# Altium schematic sheet WiFi_TF_EMMC.SchDoc
size A3; SheetNumber: 6; SheetTotal: 6
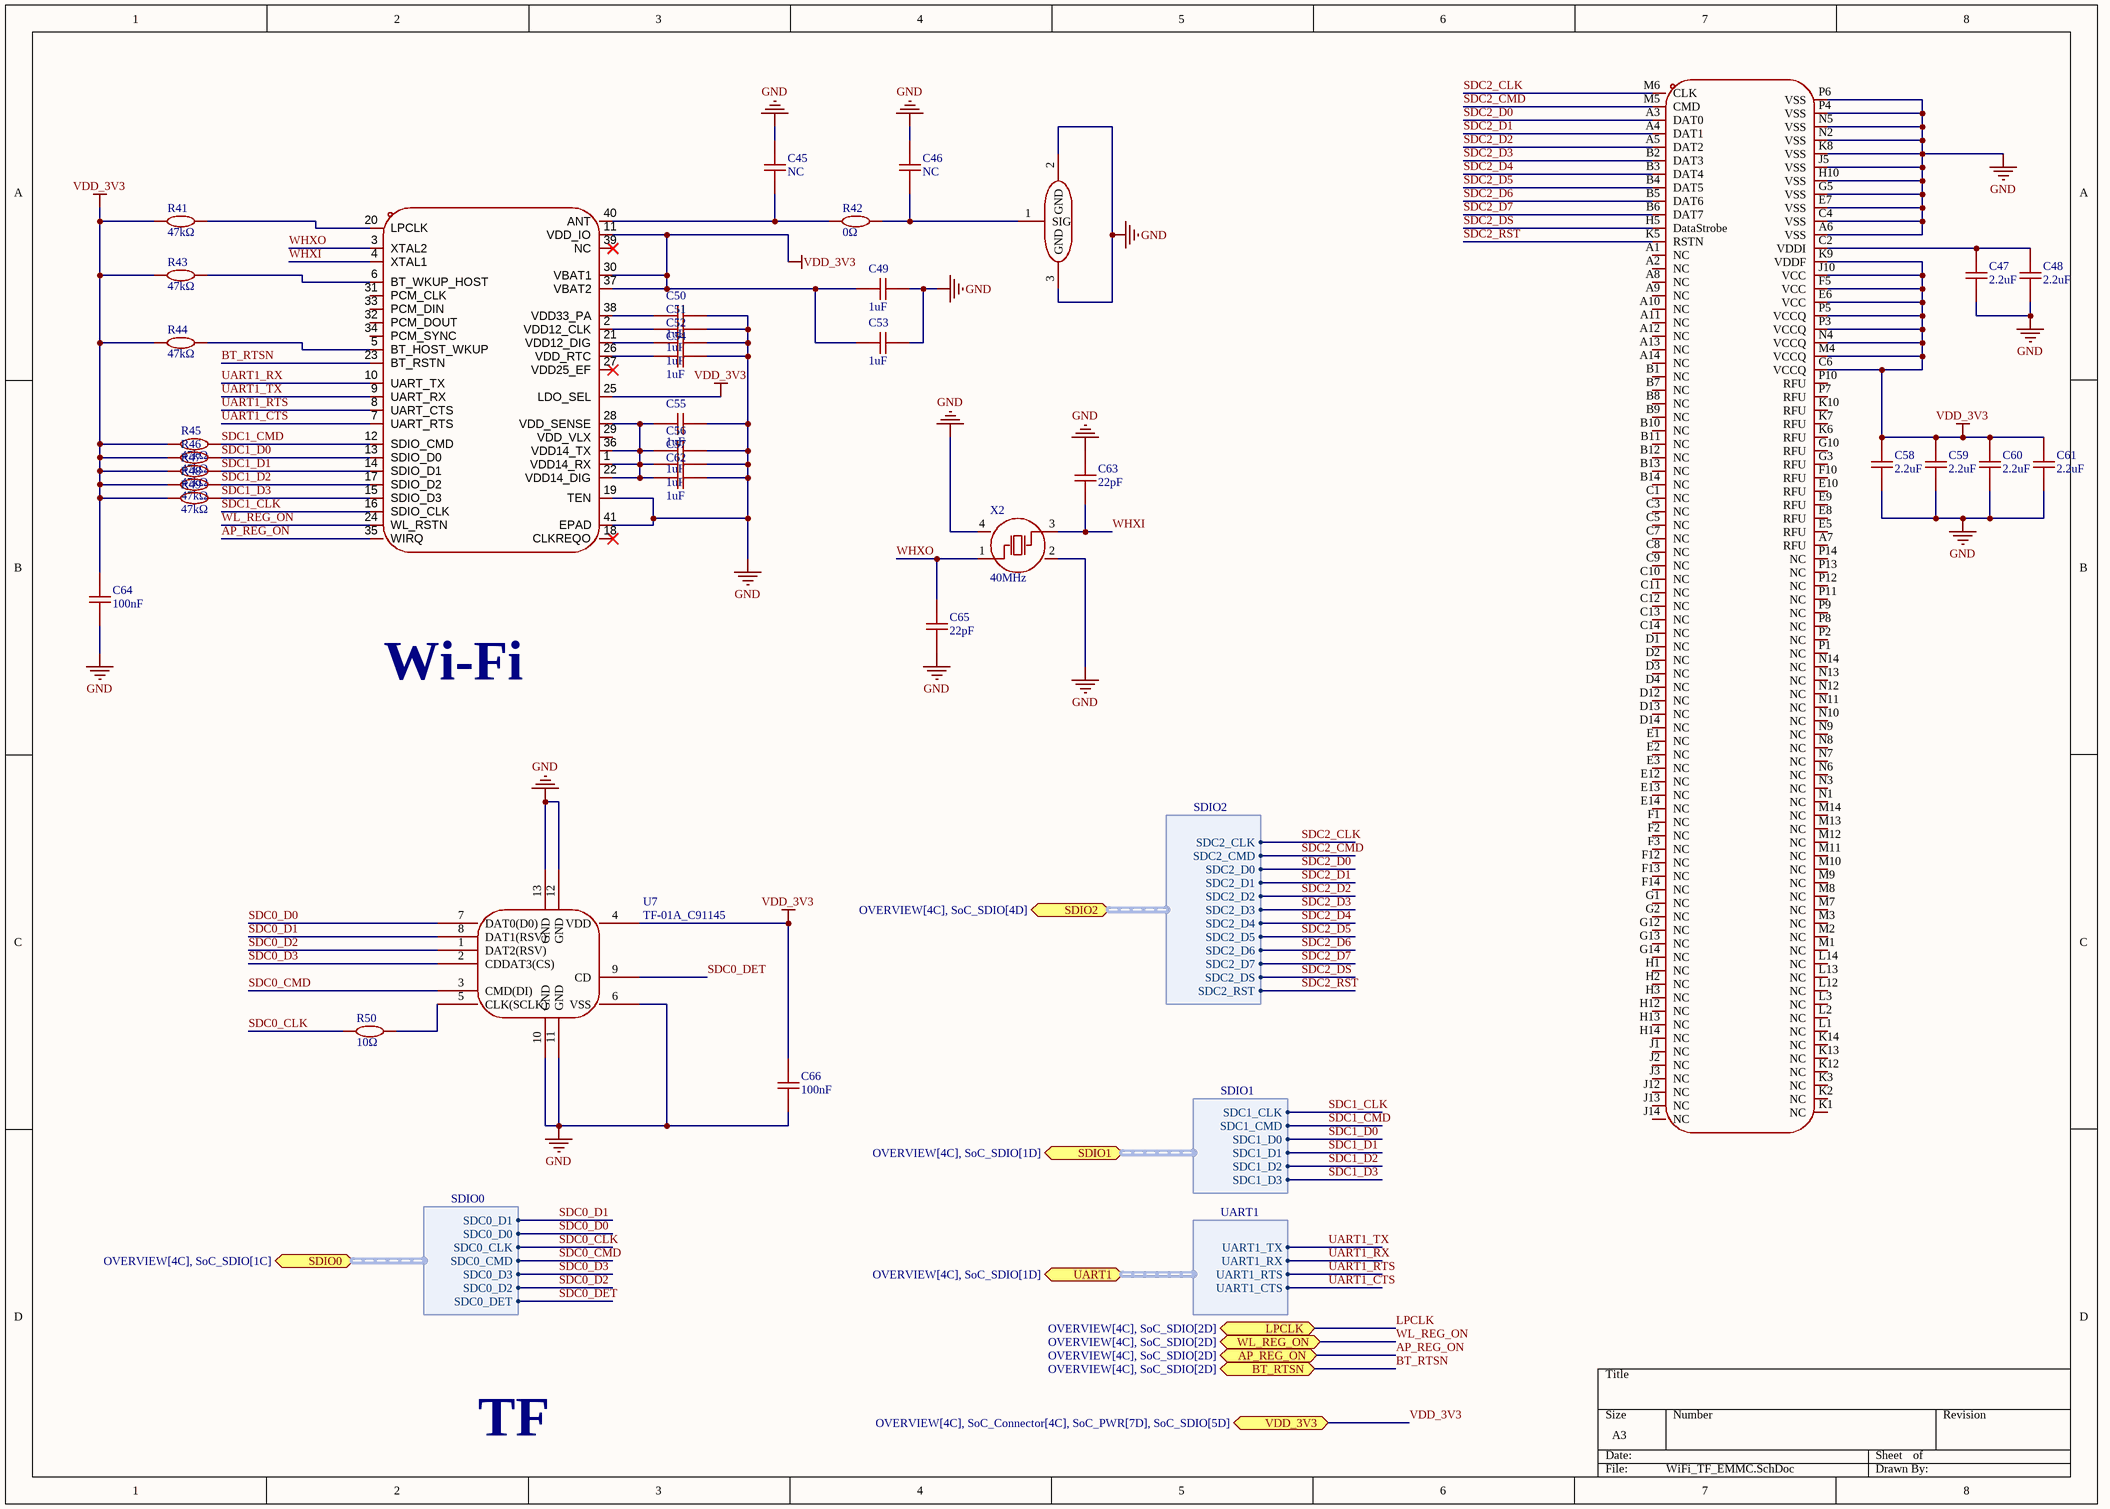
[diagram p0: WiFi_TF_EMMC.SchDoc]

## Parts
C45  NC  [C0402]
C46  NC  [C0402]
C47  2.2uF  [C0402]
C48  2.2uF  [C0402]
C49  1uF  [C0402]
C50  1uF  [C0402]
C51  1uF  [C0402]
C52  1uF  [C0402]
C53  1uF  [C0402]
C54  1uF  [C0402]
C55  1uF  [C0402]
C56  1uF  [C0402]
C57  1uF  [C0402]
C58  2.2uF  [C0402]
C59  2.2uF  [C0402]
C60  2.2uF  [C0402]
C61  2.2uF  [C0402]
C62  1uF  [C0402]
C63  22pF  [C0402]
C64  100nF  [C0402]
C65  22pF  [C0402]
C66  100nF  [C0402]
JP1  6GHz  [RF-SMD_FRF05002-JSS103M]  (value not drawn)
R41  47kΩ  [R0402]
R42  0Ω  [R0402]
R43  47kΩ  [R0402]
R44  47kΩ  [R0402]
R45  47kΩ  [R0402]
R46  47kΩ  [R0402]
R47  47kΩ  [R0402]
R48  47kΩ  [R0402]
R49  47kΩ  [R0402]
R50  10Ω  [R0402]
U6  XR829  [QFN-40_L5.0-W5.0-P0.40-BL-EP3.4]  (value not drawn)
U7  TF-01A_C91145  [TF-SMD_TF-01A]
U8  KLM8G1GETF-B041  [FBGA-153_L13.0-W11.5-P0.50_KLMAG1JETD-B041]  (value not drawn)
X2  40MHz  [OSC-SMD_4P-L3.2-W2.5-BL_SIT8008BI]

## Ports
AP_REG_ON (bidir, see OVERVIEW[4C], SoC_SDIO[2D]), BT_RTSN (bidir, see OVERVIEW[4C], SoC_SDIO[2D]), LPCLK (bidir, see OVERVIEW[4C], SoC_SDIO[2D]), SDIO0 (bidir, harness SDIO0, see OVERVIEW[4C], SoC_SDIO[1C]), SDIO1 (bidir, harness SDIO1, see OVERVIEW[4C], SoC_SDIO[1D]), SDIO2 (bidir, harness SDIO2, see OVERVIEW[4C], SoC_SDIO[4D]), UART1 (bidir, harness UART1, see OVERVIEW[4C], SoC_SDIO[1D]), VDD_3V3 (bidir, see OVERVIEW[4C], SoC_Connector[4C], SoC_PWR[7D], SoC_SDIO[5D]), WL_REG_ON (bidir, see OVERVIEW[4C], SoC_SDIO[2D])

## Harnesses
SDIO1: SDC1_D0, SDC1_D1, SDC1_CMD, SDC1_D2, SDC1_D3, SDC1_CLK
UART1: UART1_RX, UART1_RTS, UART1_TX, UART1_CTS
SDIO0: SDC0_CLK, SDC0_CMD, SDC0_D0, SDC0_D3, SDC0_D2, SDC0_D1, SDC0_DET
SDIO2: SDC2_D2, SDC2_D3, SDC2_D1, SDC2_D4, SDC2_D5, SDC2_D0, SDC2_CMD, SDC2_CLK, SDC2_D6, SDC2_D7, SDC2_DS, SDC2_RST

## Nets
GND: C45.2 C46.2 C47.1 C48.1 C49.1 C50.1 C51.1 C52.1 C53.1 C54.1 C55.1 C56.1 C57.1 C58.1 C59.1 C60.1 C61.1 C62.1 C63.2 C64.1 C65.1 C66.1 JP1.2(GND) JP1.3(GND) U6.19(TEN) U6.41(EPAD) U7.6(VSS) U7.10(GND) U7.11(GND) U7.12(GND) U7.13(GND) U8.A6(VSS) U8.C4(VSS) U8.E7(VSS) U8.G5(VSS) U8.H10(VSS) U8.J5(VSS) U8.K8(VSS) U8.N2(VSS) U8.N5(VSS) U8.P4(VSS) U8.P6(VSS) X2.2(GND) X2.4(GND)
VDD_3V3: C49.2 C53.2 C58.2 C59.2 C60.2 C61.2 C64.2 C66.2 R41.1 R43.1 R44.1 R45.1 R46.1 R47.1 R48.1 R49.1 U6.11(VDD_IO) U6.25(LDO_SEL) U6.30(VBAT1) U6.37(VBAT2) U7.4(VDD) U8.C6(VCCQ) U8.E6(VCC) U8.F5(VCC) U8.J10(VCC) U8.K9(VDDF) U8.M4(VCCQ) U8.N4(VCCQ) U8.P3(VCCQ) U8.P5(VCCQ) ; port VDD_3V3
AP_REG_ON: U6.35(WIRQ) ; port AP_REG_ON
BT_RTSN: U6.23(BT_RSTN) ; port BT_RTSN
LPCLK: port LPCLK
SDC0_CLK: R50.1 ; port SDIO0.SDC0_CLK
SDC0_CMD: U7.3(CMD(DI)) ; port SDIO0.SDC0_CMD
SDC0_D0: U7.7(DAT0(D0)) ; port SDIO0.SDC0_D0
SDC0_D1: U7.8(DAT1(RSV)) ; port SDIO0.SDC0_D1
SDC0_D2: U7.1(DAT2(RSV)) ; port SDIO0.SDC0_D2
SDC0_D3: U7.2(CDDAT3(CS)) ; port SDIO0.SDC0_D3
SDC0_DET: U7.9(CD) ; port SDIO0.SDC0_DET
SDC1_CLK: U6.16(SDIO_CLK) ; port SDIO1.SDC1_CLK
SDC1_CMD: R45.2 U6.12(SDIO_CMD) ; port SDIO1.SDC1_CMD
SDC1_D0: R46.2 U6.13(SDIO_D0) ; port SDIO1.SDC1_D0
SDC1_D1: R47.2 U6.14(SDIO_D1) ; port SDIO1.SDC1_D1
SDC1_D2: R48.2 U6.17(SDIO_D2) ; port SDIO1.SDC1_D2
SDC1_D3: R49.2 U6.15(SDIO_D3) ; port SDIO1.SDC1_D3
SDC2_CLK: U8.M6(CLK) ; port SDIO2.SDC2_CLK
SDC2_CMD: U8.M5(CMD) ; port SDIO2.SDC2_CMD
SDC2_D0: U8.A3(DAT0) ; port SDIO2.SDC2_D0
SDC2_D1: U8.A4(DAT1) ; port SDIO2.SDC2_D1
SDC2_D2: U8.A5(DAT2) ; port SDIO2.SDC2_D2
SDC2_D3: U8.B2(DAT3) ; port SDIO2.SDC2_D3
SDC2_D4: U8.B3(DAT4) ; port SDIO2.SDC2_D4
SDC2_D5: U8.B4(DAT5) ; port SDIO2.SDC2_D5
SDC2_D6: U8.B5(DAT6) ; port SDIO2.SDC2_D6
SDC2_D7: U8.B6(DAT7) ; port SDIO2.SDC2_D7
SDC2_DS: U8.H5(DataStrobe) ; port SDIO2.SDC2_DS
SDC2_RST: U8.K5(RSTN) ; port SDIO2.SDC2_RST
UART1_CTS: U6.7(UART_RTS) ; port UART1.UART1_CTS
UART1_RTS: U6.8(UART_CTS) ; port UART1.UART1_RTS
UART1_RX: U6.10(UART_TX) ; port UART1.UART1_RX
UART1_TX: U6.9(UART_RX) ; port UART1.UART1_TX
WHXI: C63.1 U6.4(XTAL1) X2.3(OSC2)
WHXO: C65.2 U6.3(XTAL2) X2.1(OSC1)
WL_REG_ON: U6.24(WL_RSTN) ; port WL_REG_ON
NetC45_1: C45.1 R42.1 U6.40(ANT)
NetC46_1: C46.1 JP1.1(SIG) R42.2
NetC47_2: C47.2 C48.2 U8.C2(VDDI)
NetC50_2: C50.2 U6.38(VDD33_PA)
NetC51_2: C51.2 U6.2(VDD12_CLK)
NetC52_2: C52.2 U6.21(VDD12_DIG)
NetC54_2: C54.2 U6.26(VDD_RTC)
NetC55_2: C55.2 C56.2 C57.2 C62.2 U6.1(VDD14_RX) U6.22(VDD14_DIG) U6.28(VDD_SENSE) U6.36(VDD14_TX)
NetR41_2: R41.2 U6.20(LPCLK)
NetR43_2: R43.2 U6.6(BT_WKUP_HOST)
NetR44_2: R44.2 U6.5(BT_HOST_WKUP)
NetR50_2: R50.2 U7.5(CLK(SCLK))

Not connected (* = marked no-connect by the designer): U6 18(CLKREQO)* 27(VDD25_EF)* 29(VDD_VLX) 31(PCM_CLK) 32(PCM_DOUT) 33(PCM_DIN) 34(PCM_SYNC) 39(NC)*; U8 A1(NC) A2(NC) A7(RFU) A8(NC) A9(NC) A10(NC) A11(NC) A12(NC) A13(NC) A14(NC) B1(NC) B7(NC) B8(NC) B9(NC) B10(NC) B11(NC) B12(NC) B13(NC) B14(NC) C1(NC) C3(NC) C5(NC) C7(NC) C8(NC) C9(NC) C10(NC) C11(NC) C12(NC) C13(NC) C14(NC) D1(NC) D2(NC) D3(NC) D4(NC) D12(NC) D13(NC) D14(NC) E1(NC) E2(NC) E3(NC) E5(RFU) E8(RFU) E9(RFU) E10(RFU) E12(NC) E13(NC) E14(NC) F1(NC) F2(NC) F3(NC) F10(RFU) F12(NC) F13(NC) F14(NC) G1(NC) G2(NC) G3(RFU) G10(RFU) G12(NC) G13(NC) G14(NC) H1(NC) H2(NC) H3(NC) H12(NC) H13(NC) H14(NC) J1(NC) J2(NC) J3(NC) J12(NC) J13(NC) J14(NC) K1(NC) K2(NC) K3(NC) K6(RFU) K7(RFU) K10(RFU) K12(NC) K13(NC) K14(NC) L1(NC) L2(NC) L3(NC) L12(NC) L13(NC) L14(NC) M1(NC) M2(NC) M3(NC) M7(NC) M8(NC) M9(NC) M10(NC) M11(NC) M12(NC) M13(NC) M14(NC) N1(NC) N3(NC) N6(NC) N7(NC) N8(NC) N9(NC) N10(NC) N11(NC) N12(NC) N13(NC) N14(NC) P1(NC) P2(NC) P7(RFU) P8(NC) P9(NC) P10(RFU) P11(NC) P12(NC) P13(NC) P14(NC)

## Notes on the sheet
- Wi-Fi
- TF

## Library data of the parts
C45 C46 C64 C66 = 100nF: 50V 100nF X7R ±10% 0402 Ceramic Capacitors ROHS
C47 C48 C58-C61 = 2.2uF: 50V 2.2uF NP0 0402 Ceramic Capacitors ROHS
C49-C57 C62 = 1uF: 50V 1uF X5R ±10% 0402 Ceramic Capacitors ROHS
C63 C65 = 22pF: 50V 22pF C0G ±5% 0402 Ceramic Capacitors ROHS
JP1 = U.FL-R-SMT-1(80)_C88374: Manufacturer: HRS(广濑); Add into BOM: yes; Connector Type: Board Side; Interface: Male Pin; Number of Ports: 1; Interface Diameter: 2mm; Interface Length/Height: 1.25mm; RF Series: IPEX; Impedance: 50Ω; Symbol: U.FL-R-SMT-1(80); Device: U.FL-R-SMT-1(80)_C88374; LCSC Part Name: IPEX 内针; Supplier Part: C88374; Manufacturer Part: U.FL-R-SMT-1(80); Supplier Footprint: SMD; JLCPCB Part Class: Extended Part; Datasheet: https://item.szlcsc.com/datasheet/U.FL-R-SMT-1(80)/89553.html; Supplier: LCSC; Convert to PCB: yes; Value: 6GHz; Style: -; Operating Temperature Range: -40℃~+90℃
R41 R43-R49 = 47kΩ: 62.5mW 47kΩ 50V ±100ppm/℃ Thick Film Resistor ±1% 0402 Chip Resistor - Surface Mount ROHS
R42 = 0Ω: 0Ω 62.5mW 50V Thick Film Resistor ±1% 0402 Chip Resistor - Surface Mount ROHS
R50 = 10Ω: 10Ω 62.5mW 50V ±200ppm/℃ Thick Film Resistor ±1% 0402 Chip Resistor - Surface Mount ROHS
U6 = XR829: 2.4GHz WiFi and Bluetooth chips; Symbol: XR829_1
U7 = TF-01A_C91145: Push-Push 1.85mm Connector and Ejector MicroSD Card (TF Card) SMD PC Card Sockets ROHS
U8 = KLM8G1GETF-B041_1: 8GB 2.7V~3.6V eMMC 5.1 330/50 MB/s FBGA-153(11.5x13) Memory (ICs) ROHS; Manufacturer: SAMSUNG(三星半导体); Add into BOM: yes; Reading Speed in Sequence: 330MB/S; Writing Speed in Sequence: 50MB/S; Controller Operating Voltage (VCCQ): 2.7V~3.6V；1.7V~1.95V; Symbol: KLM8G1GETF-B041; Device: KLM8G1GETF-B041; LCSC Part Name: KLM8G1GETF-B041; Supplier Part: C499918; Manufacturer Part: KLM8G1GETF-B041; Supplier Footprint: FBGA-153(11.5x13); JLCPCB Part Class: Extended Part; Datasheet: https://item.szlcsc.com/datasheet/KLM8G1GETF-B041/512098.html; Supplier: LCSC; Convert to PCB: yes; configuration: -; Interface: eMMC 5.1; Voltage - Supply: 2.7V~3.6V; Operating Temperature: -25℃~+85℃; Sequential Read/Write (MB/s): 330/50 MB/s; Random Read/Write (IOPS): -; Memory Size: 8GB; NAND Operating Voltage (VCCF): 2.7V~3.6V
X2 = X322540MPB4SI: Crystal Oscillator 15pF SMD3225-4P Crystals ROHS